# EAGLE design protoboard (EAGLE 9.4.2)

## Sheet 1 of 2
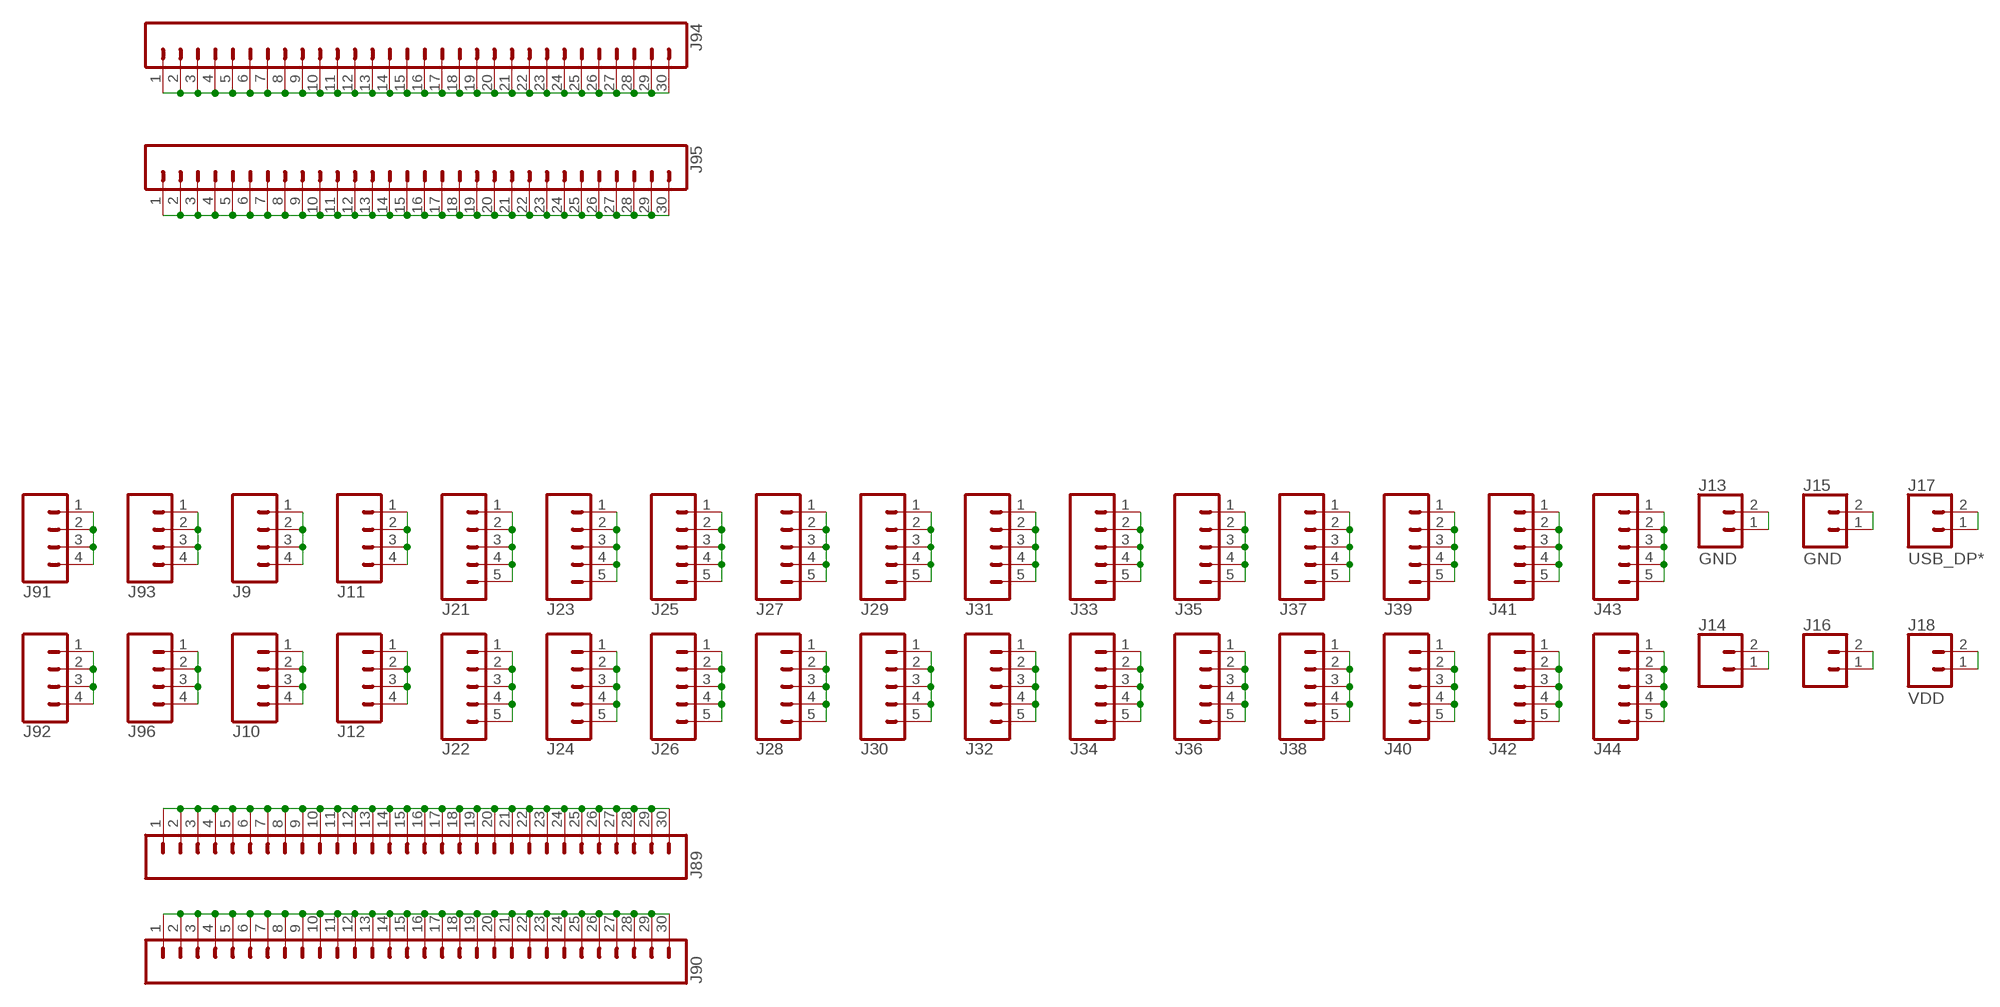
[diagram p0: schematic, sheet 1, part 1 of 2]
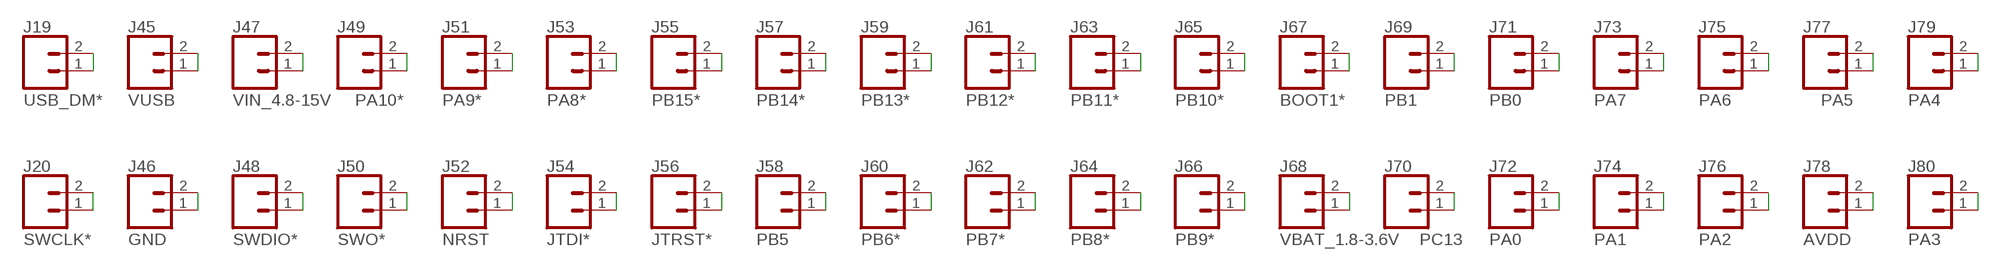
[diagram p1: schematic, sheet 1, part 2 of 2]

### Parts
J9  CONN_041X04_NO_SILK  [1X04_NO_SILK]
J10  CONN_041X04_NO_SILK  [1X04_NO_SILK]
J11  CONN_041X04_NO_SILK  [1X04_NO_SILK]
J12  CONN_041X04_NO_SILK  [1X04_NO_SILK]
J13  CONN_021X02_NO_SILK  [1X02_NO_SILK]
J14  CONN_021X02_NO_SILK  [1X02_NO_SILK]
J15  CONN_021X02_NO_SILK  [1X02_NO_SILK]
J16  CONN_021X02_NO_SILK  [1X02_NO_SILK]
J17  CONN_021X02_NO_SILK  [1X02_NO_SILK]
J18  CONN_021X02_NO_SILK  [1X02_NO_SILK]
J19  CONN_021X02_NO_SILK  [1X02_NO_SILK]
J20  CONN_021X02_NO_SILK  [1X02_NO_SILK]
J21  CONN_05NO_SILK  [1X05_NO_SILK]
J22  CONN_05NO_SILK  [1X05_NO_SILK]
J23  CONN_05NO_SILK  [1X05_NO_SILK]
J24  CONN_05NO_SILK  [1X05_NO_SILK]
J25  CONN_05NO_SILK  [1X05_NO_SILK]
J26  CONN_05NO_SILK  [1X05_NO_SILK]
J27  CONN_05NO_SILK  [1X05_NO_SILK]
J28  CONN_05NO_SILK  [1X05_NO_SILK]
J29  CONN_05NO_SILK  [1X05_NO_SILK]
J30  CONN_05NO_SILK  [1X05_NO_SILK]
J31  CONN_05NO_SILK  [1X05_NO_SILK]
J32  CONN_05NO_SILK  [1X05_NO_SILK]
J33  CONN_05NO_SILK  [1X05_NO_SILK]
J34  CONN_05NO_SILK  [1X05_NO_SILK]
J35  CONN_05NO_SILK  [1X05_NO_SILK]
J36  CONN_05NO_SILK  [1X05_NO_SILK]
J37  CONN_05NO_SILK  [1X05_NO_SILK]
J38  CONN_05NO_SILK  [1X05_NO_SILK]
J39  CONN_05NO_SILK  [1X05_NO_SILK]
J40  CONN_05NO_SILK  [1X05_NO_SILK]
J41  CONN_05NO_SILK  [1X05_NO_SILK]
J42  CONN_05NO_SILK  [1X05_NO_SILK]
J43  CONN_05NO_SILK  [1X05_NO_SILK]
J44  CONN_05NO_SILK  [1X05_NO_SILK]
J45  CONN_021X02_NO_SILK  [1X02_NO_SILK]
J46  CONN_021X02_NO_SILK  [1X02_NO_SILK]
J47  CONN_021X02_NO_SILK  [1X02_NO_SILK]
J48  CONN_021X02_NO_SILK  [1X02_NO_SILK]
J49  CONN_021X02_NO_SILK  [1X02_NO_SILK]
J50  CONN_021X02_NO_SILK  [1X02_NO_SILK]
J51  CONN_021X02_NO_SILK  [1X02_NO_SILK]
J52  CONN_021X02_NO_SILK  [1X02_NO_SILK]
J53  CONN_021X02_NO_SILK  [1X02_NO_SILK]
J54  CONN_021X02_NO_SILK  [1X02_NO_SILK]
J55  CONN_021X02_NO_SILK  [1X02_NO_SILK]
J56  CONN_021X02_NO_SILK  [1X02_NO_SILK]
J57  CONN_021X02_NO_SILK  [1X02_NO_SILK]
J58  CONN_021X02_NO_SILK  [1X02_NO_SILK]
J59  CONN_021X02_NO_SILK  [1X02_NO_SILK]
J60  CONN_021X02_NO_SILK  [1X02_NO_SILK]
J61  CONN_021X02_NO_SILK  [1X02_NO_SILK]
J62  CONN_021X02_NO_SILK  [1X02_NO_SILK]
J63  CONN_021X02_NO_SILK  [1X02_NO_SILK]
J64  CONN_021X02_NO_SILK  [1X02_NO_SILK]
J65  CONN_021X02_NO_SILK  [1X02_NO_SILK]
J66  CONN_021X02_NO_SILK  [1X02_NO_SILK]
J67  CONN_021X02_NO_SILK  [1X02_NO_SILK]
J68  CONN_021X02_NO_SILK  [1X02_NO_SILK]
J69  CONN_021X02_NO_SILK  [1X02_NO_SILK]
J70  CONN_021X02_NO_SILK  [1X02_NO_SILK]
J71  CONN_021X02_NO_SILK  [1X02_NO_SILK]
J72  CONN_021X02_NO_SILK  [1X02_NO_SILK]
J73  CONN_021X02_NO_SILK  [1X02_NO_SILK]
J74  CONN_021X02_NO_SILK  [1X02_NO_SILK]
J75  CONN_021X02_NO_SILK  [1X02_NO_SILK]
J76  CONN_021X02_NO_SILK  [1X02_NO_SILK]
J77  CONN_021X02_NO_SILK  [1X02_NO_SILK]
J78  CONN_021X02_NO_SILK  [1X02_NO_SILK]
J79  CONN_021X02_NO_SILK  [1X02_NO_SILK]
J80  CONN_021X02_NO_SILK  [1X02_NO_SILK]
J89  CONN_30NO_SILK  [1X30_NO_SILK]
J90  CONN_30NO_SILK  [1X30_NO_SILK]
J91  CONN_041X04_NO_SILK  [1X04_NO_SILK]
J92  CONN_041X04_NO_SILK  [1X04_NO_SILK]
J93  CONN_041X04_NO_SILK  [1X04_NO_SILK]
J94  CONN_30NO_SILK  [1X30_NO_SILK]
J95  CONN_30NO_SILK  [1X30_NO_SILK]
J96  CONN_041X04_NO_SILK  [1X04_NO_SILK]

### Nets
AVDD: J78.1 J78.2 ; also sheet 2
BOOT1*: J67.1 J67.2 ; also sheet 2
GND: J13.1 J13.2 J15.1 J15.2 J46.1 J46.2 ; also sheet 2
JTDI*: J54.1 J54.2 ; also sheet 2
JTRST*: J56.1 J56.2 ; also sheet 2
N$1: J90.1 J90.2 J90.3 J90.4 J90.5 J90.6 J90.7 J90.8 J90.9 J90.10 J90.11 J90.12 J90.13 J90.14 J90.15 J90.16 J90.17 J90.18 J90.19 J90.20 J90.21 J90.22 J90.23 J90.24 J90.25 J90.26 J90.27 J90.28 J90.29 J90.30
N$2: J89.1 J89.2 J89.3 J89.4 J89.5 J89.6 J89.7 J89.8 J89.9 J89.10 J89.11 J89.12 J89.13 J89.14 J89.15 J89.16 J89.17 J89.18 J89.19 J89.20 J89.21 J89.22 J89.23 J89.24 J89.25 J89.26 J89.27 J89.28 J89.29 J89.30
N$3: J95.1 J95.2 J95.3 J95.4 J95.5 J95.6 J95.7 J95.8 J95.9 J95.10 J95.11 J95.12 J95.13 J95.14 J95.15 J95.16 J95.17 J95.18 J95.19 J95.20 J95.21 J95.22 J95.23 J95.24 J95.25 J95.26 J95.27 J95.28 J95.29 J95.30
N$4: J94.1 J94.2 J94.3 J94.4 J94.5 J94.6 J94.7 J94.8 J94.9 J94.10 J94.11 J94.12 J94.13 J94.14 J94.15 J94.16 J94.17 J94.18 J94.19 J94.20 J94.21 J94.22 J94.23 J94.24 J94.25 J94.26 J94.27 J94.28 J94.29 J94.30
N$5: J92.1 J92.2 J92.3 J92.4
N$6: J96.1 J96.2 J96.3 J96.4
N$7: J10.1 J10.2 J10.3 J10.4
N$8: J12.1 J12.2 J12.3 J12.4
N$9: J22.1 J22.2 J22.3 J22.4 J22.5
N$10: J24.1 J24.2 J24.3 J24.4 J24.5
N$11: J26.1 J26.2 J26.3 J26.4 J26.5
N$12: J28.1 J28.2 J28.3 J28.4 J28.5
N$13: J30.1 J30.2 J30.3 J30.4 J30.5
N$14: J32.1 J32.2 J32.3 J32.4 J32.5
N$15: J34.1 J34.2 J34.3 J34.4 J34.5
N$16: J36.1 J36.2 J36.3 J36.4 J36.5
N$17: J38.1 J38.2 J38.3 J38.4 J38.5
N$18: J40.1 J40.2 J40.3 J40.4 J40.5
N$19: J42.1 J42.2 J42.3 J42.4 J42.5
N$20: J44.1 J44.2 J44.3 J44.4 J44.5
N$22: J14.1 J14.2
N$23: J16.1 J16.2
N$40: J91.1 J91.2 J91.3 J91.4
N$41: J93.1 J93.2 J93.3 J93.4
N$42: J9.1 J9.2 J9.3 J9.4
N$43: J11.1 J11.2 J11.3 J11.4
N$44: J21.1 J21.2 J21.3 J21.4 J21.5
N$45: J23.1 J23.2 J23.3 J23.4 J23.5
N$46: J25.1 J25.2 J25.3 J25.4 J25.5
N$47: J27.1 J27.2 J27.3 J27.4 J27.5
N$48: J29.1 J29.2 J29.3 J29.4 J29.5
N$49: J31.1 J31.2 J31.3 J31.4 J31.5
N$50: J33.1 J33.2 J33.3 J33.4 J33.5
N$51: J35.1 J35.2 J35.3 J35.4 J35.5
N$52: J37.1 J37.2 J37.3 J37.4 J37.5
N$53: J39.1 J39.2 J39.3 J39.4 J39.5
N$54: J41.1 J41.2 J41.3 J41.4 J41.5
N$55: J43.1 J43.2 J43.3 J43.4 J43.5
NRST: J52.1 J52.2 ; also sheet 2
PA0: J72.1 J72.2 ; also sheet 2
PA1: J74.1 J74.2 ; also sheet 2
PA2: J76.1 J76.2 ; also sheet 2
PA3: J80.1 J80.2 ; also sheet 2
PA4: J79.1 J79.2 ; also sheet 2
PA5: J77.1 J77.2 ; also sheet 2
PA6: J75.1 J75.2 ; also sheet 2
PA7: J73.1 J73.2 ; also sheet 2
PA8*: J53.1 J53.2 ; also sheet 2
PA9*: J51.1 J51.2 ; also sheet 2
PA10*: J49.1 J49.2 ; also sheet 2
PB0: J71.1 J71.2 ; also sheet 2
PB1: J69.1 J69.2 ; also sheet 2
PB5: J58.1 J58.2 ; also sheet 2
PB6*: J60.1 J60.2 ; also sheet 2
PB7*: J62.1 J62.2 ; also sheet 2
PB8*: J64.1 J64.2 ; also sheet 2
PB9*: J66.1 J66.2 ; also sheet 2
PB10*: J65.1 J65.2 ; also sheet 2
PB11*: J63.1 J63.2 ; also sheet 2
PB12*: J61.1 J61.2 ; also sheet 2
PB13*: J59.1 J59.2 ; also sheet 2
PB14*: J57.1 J57.2 ; also sheet 2
PB15*: J55.1 J55.2 ; also sheet 2
PC13: J70.1 J70.2 ; also sheet 2
SWCLK*: J20.1 J20.2 ; also sheet 2
SWDIO*: J48.1 J48.2 ; also sheet 2
SWO*: J50.1 J50.2 ; also sheet 2
USB_DM*: J19.1 J19.2 ; also sheet 2
USB_DP*: J17.1 J17.2 ; also sheet 2
VBAT_1.8-3.6V: J68.1 J68.2 ; also sheet 2
VDD: J18.1 J18.2 ; also sheet 2
VIN_4.8-15V: J47.1 J47.2 ; also sheet 2
VUSB: J45.1 J45.2 ; also sheet 2

## Sheet 2 of 2
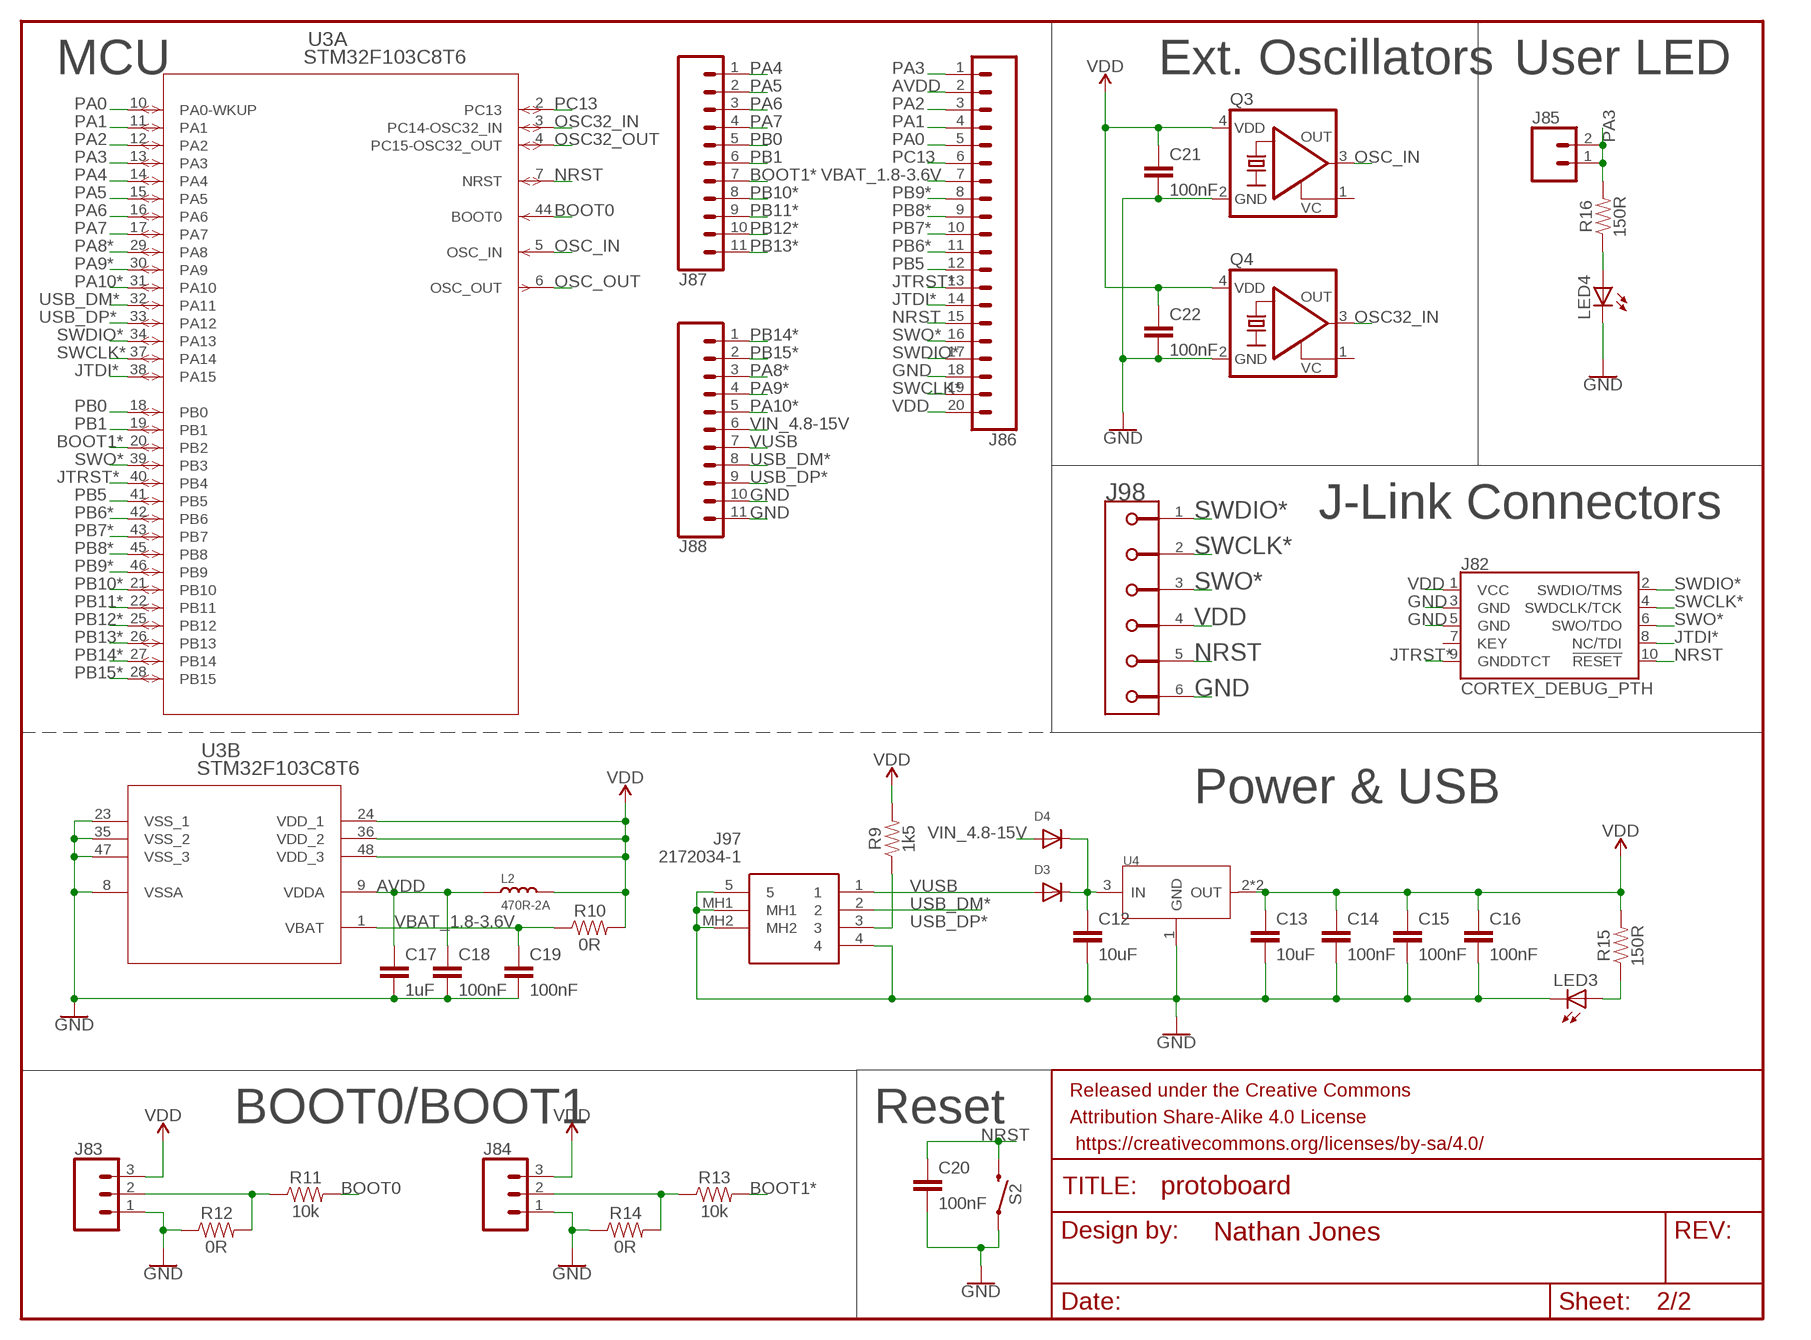
[diagram p2: schematic, sheet 2]

### Parts
C12  10uF  0.1UF-0402T-16V-10%  [0402-TIGHT]
C13  10uF  0.1UF-0402T-16V-10%  [0402-TIGHT]
C14  100nF  0.1UF-0402T-16V-10%  [0402-TIGHT]
C15  100nF  0.1UF-0402T-16V-10%  [0402-TIGHT]
C16  100nF  0.1UF-0402T-16V-10%  [0402-TIGHT]
C17  1uF  0.1UF-0402T-16V-10%  [0402-TIGHT]
C18  100nF  0.1UF-0402T-16V-10%  [0402-TIGHT]
C19  100nF  0.1UF-0402T-16V-10%  [0402-TIGHT]
C20  100nF  0.1UF-0402T-16V-10%  [0402-TIGHT]
C21  100nF  0.1UF-0402T-16V-10%  [0402-TIGHT]
C22  100nF  0.1UF-0402T-16V-10%  [0402-TIGHT]
D3  DIODESOD-123  [SOD-123]
D4  DIODESOD-123  [SOD-123]
FRAME1  FRAME-LETTERNO_PACKAGE  [DUMMY]
J82  CORTEX_DEBUG_PTH  [2X5-PTH-1.27MM]
J83  CONN_031X03_NO_SILK  [1X03_NO_SILK]
J84  CONN_031X03_NO_SILK  [1X03_NO_SILK]
J85  CONN_021X02_NO_SILK  [1X02_NO_SILK]
J86  CONN_20NOSILK  [1X20_NOSILK]
J87  CONN_111X11_NO_SILK  [1X11_NO_SILK]
J88  CONN_111X11_NO_SILK  [1X11_NO_SILK]
J97  2172034-1  [21720341]
J98  AVX_6-PIN_009159006061916_33MIL-GAP  [AVX_6-PIN_009159006061916_33MIL-GAP]
L2  470R-2A  SMD-FERRITE-BEAD-470R-2A(0805)'0805'  [L0805]
LED3  LEDCHIPLED_0603  [CHIPLED_0603]
LED4  LEDCHIPLED_0603  [CHIPLED_0603]
Q3  KXO-VCXO-CMOS_4  [3.2X2.5_KXO-84-TCXO]
Q4  KXO-VCXO-CMOS_4  [3.2X2.5_KXO-84-TCXO]
R9  1k5  RESISTOR0402  [0402]
R10  0R  RESISTOR0402  [0402]
R11  10k  RESISTOR0402  [0402]
R12  0R  RESISTOR0402  [0402]
R13  10k  RESISTOR0402  [0402]
R14  0R  RESISTOR0402  [0402]
R15  150R  RESISTOR0402  [0402]
R16  150R  RESISTOR0402  [0402]
S2  MOMENTARY-SWITCH-SPST-SMD-5.2-REDUNDANT  [TACTILE_SWITCH_SMD_5.2MM]
U3  STM32F103C8T6  [LQFP48-7X7MM]
U4  CJT1117-3.3-SOT223  PMIC-CJT1117-3.3(SOT223)  [SOT-223]

### Nets
AVDD: C17.1 C18.1 J86.2 L2.1 U3.9(B:VDDA) ; also sheet 1
BOOT0: R11.2 U3.44(A:BOOT0)
BOOT1*: J87.7 R13.2 U3.20(A:PB2) ; also sheet 1
GND: C12.2 C13.2 C14.2 C15.2 C16.2 C17.2 C18.2 C19.2 C20.2 C21.2 C22.2 J82.3(GND) J82.5(GND) J83.1 J84.1 J86.18 J88.10 J88.11 J97.4 J97.5 J97.MH1 J97.MH2 J98.6 LED3.C LED4.C Q3.2(GND) Q4.2(GND) R12.1 R14.1 S2.1 S2.2 U3.8(B:VSSA) U3.23(B:VSS_1) U3.35(B:VSS_2) U3.47(B:VSS_3) U4.1(GND) ; also sheet 1
JTDI*: J82.8(NC/TDI) J86.14 U3.38(A:PA15) ; also sheet 1
JTRST*: J82.9(GNDDTCT) J86.13 U3.40(A:PB4) ; also sheet 1
N$58: J83.2 R11.1 R12.2
N$59: J84.2 R13.1 R14.2
N$60: LED4.A R16.1
N$61: LED3.A R15.1
NRST: C20.1 J82.10(!RESET) J86.15 J98.5 S2.3 S2.4 U3.7(A:NRST) ; also sheet 1
OSC32_IN: Q4.3(OUT) U3.3(A:PC14-OSC32_IN)
OSC32_OUT: U3.4(A:PC15-OSC32_OUT)
OSC_IN: Q3.3(OUT) U3.5(A:OSC_IN)
OSC_OUT: U3.6(A:OSC_OUT)
PA0: J86.5 U3.10(A:PA0-WKUP) ; also sheet 1
PA1: J86.4 U3.11(A:PA1) ; also sheet 1
PA2: J86.3 U3.12(A:PA2) ; also sheet 1
PA3: J85.1 J85.2 J86.1 R16.2 U3.13(A:PA3) ; also sheet 1
PA4: J87.1 U3.14(A:PA4) ; also sheet 1
PA5: J87.2 U3.15(A:PA5) ; also sheet 1
PA6: J87.3 U3.16(A:PA6) ; also sheet 1
PA7: J87.4 U3.17(A:PA7) ; also sheet 1
PA8*: J88.3 U3.29(A:PA8) ; also sheet 1
PA9*: J88.4 U3.30(A:PA9) ; also sheet 1
PA10*: J88.5 U3.31(A:PA10) ; also sheet 1
PB0: J87.5 U3.18(A:PB0) ; also sheet 1
PB1: J87.6 U3.19(A:PB1) ; also sheet 1
PB5: J86.12 U3.41(A:PB5) ; also sheet 1
PB6*: J86.11 U3.42(A:PB6) ; also sheet 1
PB7*: J86.10 U3.43(A:PB7) ; also sheet 1
PB8*: J86.9 U3.45(A:PB8) ; also sheet 1
PB9*: J86.8 U3.46(A:PB9) ; also sheet 1
PB10*: J87.8 U3.21(A:PB10) ; also sheet 1
PB11*: J87.9 U3.22(A:PB11) ; also sheet 1
PB12*: J87.10 U3.25(A:PB12) ; also sheet 1
PB13*: J87.11 U3.26(A:PB13) ; also sheet 1
PB14*: J88.1 U3.27(A:PB14) ; also sheet 1
PB15*: J88.2 U3.28(A:PB15) ; also sheet 1
PC13: J86.6 U3.2(A:PC13) ; also sheet 1
SWCLK*: J82.4(SWDCLK/TCK) J86.19 J98.2 U3.37(A:PA14) ; also sheet 1
SWDIO*: J82.2(SWDIO/TMS) J86.17 J98.1 U3.34(A:PA13) ; also sheet 1
SWO*: J82.6(SWO/TDO) J86.16 J98.3 U3.39(A:PB3) ; also sheet 1
USB_DM*: J88.8 J97.2 U3.32(A:PA11) ; also sheet 1
USB_DP*: J88.9 J97.3 R9.1 U3.33(A:PA12) ; also sheet 1
VBAT_1.8-3.6V: C19.1 J86.7 R10.1 U3.1(B:VBAT) ; also sheet 1
VDD: C13.1 C14.1 C15.1 C16.1 C21.1 C22.1 J82.1(VCC) J83.3 J84.3 J86.20 J98.4 L2.2 Q3.4(VDD) Q4.4(VDD) R9.2 R10.2 R15.2 U3.24(B:VDD_1) U3.36(B:VDD_2) U3.48(B:VDD_3) U4.2(OUT) U4.TER(OUT) ; also sheet 1
VIN2: C12.1 D3.C D4.C U4.3(IN)
VIN_4.8-15V: D4.A J88.6 ; also sheet 1
VUSB: D3.A J88.7 J97.1 ; also sheet 1
Unconnected: J82.7(KEY) Q3.1(VC) Q4.1(VC)

### Notes on the sheet
- MCU | Ext. Oscillators | User LED
- J-Link Connectors
- Power & USB
- BOOT0/BOOT1 | Reset

## Library data of the parts
C12 C13 = SparkFun-Capacitors:0.1UF: 0.1µF ceramic capacitors A capacitor is a passive two-terminal electrical component used to store electrical energy temporarily in an electric field.; LCSC_PART: C15525; PROD_ID: CAP-12416; VALUE: 0.1uF
C14-C16 C18-C22 = SparkFun-Capacitors:0.1UF: 0.1µF ceramic capacitors A capacitor is a passive two-terminal electrical component used to store electrical energy temporarily in an electric field.; LCSC_PART: C1525; PROD_ID: CAP-12416; VALUE: 0.1uF
C17 = SparkFun-Capacitors:0.1UF: 0.1µF ceramic capacitors A capacitor is a passive two-terminal electrical component used to store electrical energy temporarily in an electric field.; LCSC_PART: C52923; PROD_ID: CAP-12416; VALUE: 0.1uF
D3 D4 = adafruit:DIODE: Diode SMADIODE - SMA Surface Mount Package 20V 1A Schottky Diode Digikey: 641-1014-6-ND DO-1N4148 - Through Hole Small Current Diode SOD-123 20V 1 A (.5mV Vf) Schottky Diode - Digikey: MBRX120TPMSCT-ND SOD-323 10V 570mA (.38mV Vf, 3ns) Schottky Diode - Digikey: ZLLS410CT-ND SOD-523 30V 30mA Schottky Diode (RB751S-40TE61) - Digikey: RB751S-40TE61CT-ND SOT23-R/W - SOT23 Package (R = Solder Paste/Reflow Ovens, W = Hand-Soldering) BAT54Film 40V 300mA - Digikey: 497-7162-1-ND; LCSC_PART: C8598
FRAME1 = SparkFun-Aesthetics:FRAME-LETTER: Schematic Frame - Letter Standard 8.5x11 US Letter frame; DESIGNER: Nathan Jones; VERSION: v01
J9-J12 J91-J93 J96 = SparkFun-Connectors:CONN_04: Multi connection point. Often used as Generic Header-pin footprint for 0.1 inch spaced/style header connections On any of the 0.1 inch spaced packages, you can populate with these: Break Away Headers - Straight <https://www.sparkfun.com/products/116> (PRT-00116) Break Away Male Headers - Right Angle <https://www.sparkfun.com/products/553> (PRT-00553) Female Headers <https://www.sparkfun.com/products/115> (PRT-00115) Break Away Headers - Machine Pin <https://www.sparkfun.com/products/117> (PRT-00117) Break Away Female Headers - Swiss Machine Pin <https://www.sparkfun.com/products/743> (PRT-00743) For SCREWTERMINALS and SPRING TERMINALS visit here: Screw Terimnals on SparkFun.com <https://www.sparkfun.com/search/results?term=Screw+Terminals> (5mm/3.5mm/2.54mm spacing) This device is also useful as a general connection point to wire up your design to another part of your project. Our various solder wires solder well into these plated through hole pads. Hook-Up Wire - Assortment (Stranded, 22 AWG) <https://www.sparkfun.com/products/11375> (PRT-11375) Hook-Up Wire - Assortment (Solid Core, 22 AWG) <https://www.sparkfun.com/products/11367> (PRT-11367) View the entire wire category on our website here <https://www.sparkfun.com/categories/141> Special notes: Molex polarized connector foot print use with SKU : PRT-08231 with associated crimp pins and housings. 1MM SMD Version SKU: PRT-10208; PROD_ID: CONN-09696
J13-J20 J45-J80 J85 = SparkFun-Connectors:CONN_02: Multi connection point. Often used as Generic Header-pin footprint for 0.1 inch spaced/style header connections On any of the 0.1 inch spaced packages, you can populate with these: Break Away Headers - Straight <https://www.sparkfun.com/products/116> (PRT-00116) Break Away Male Headers - Right Angle <https://www.sparkfun.com/products/553> (PRT-00553) Female Headers <https://www.sparkfun.com/products/115> (PRT-00115) Break Away Headers - Machine Pin <https://www.sparkfun.com/products/117> (PRT-00117) Break Away Female Headers - Swiss Machine Pin <https://www.sparkfun.com/products/743> (PRT-00743) For SCREWTERMINALS and SPRING TERMINALS visit here: Screw Terimnals on SparkFun.com <https://www.sparkfun.com/search/results?term=Screw+Terminals> (5mm/3.5mm/2.54mm spacing) This device is also useful as a general connection point to wire up your design to another part of your project. Our various solder wires solder well into these plated through hole pads. Hook-Up Wire - Assortment (Stranded, 22 AWG) <https://www.sparkfun.com/products/11375> (PRT-11375) Hook-Up Wire - Assortment (Solid Core, 22 AWG) <https://www.sparkfun.com/products/11367> (PRT-11367) View the entire wire category on our website here <https://www.sparkfun.com/categories/141> Special notes: Molex polarized connector foot print use with: PRT-08233 with associated crimp pins and housings. 2.54_SCREWTERM for use with PRT-10571. 3.5mm Screw Terminal footprints for PRT-08084 5mm Screw Terminal footprints for use with PRT-08432
J21-J44 = SparkFun-Connectors:CONN_05: Multi connection point. Often used as Generic Header-pin footprint for 0.1 inch spaced/style header connections On any of the 0.1 inch spaced packages, you can populate with these: Break Away Headers - Straight <https://www.sparkfun.com/products/116> (PRT-00116) Break Away Male Headers - Right Angle <https://www.sparkfun.com/products/553> (PRT-00553) Female Headers <https://www.sparkfun.com/products/115> (PRT-00115) Break Away Headers - Machine Pin <https://www.sparkfun.com/products/117> (PRT-00117) Break Away Female Headers - Swiss Machine Pin <https://www.sparkfun.com/products/743> (PRT-00743) For SCREWTERMINALS and SPRING TERMINALS visit here: Screw Terimnals on SparkFun.com <https://www.sparkfun.com/search/results?term=Screw+Terminals> (5mm/3.5mm/2.54mm spacing) This device is also useful as a general connection point to wire up your design to another part of your project. Our various solder wires solder well into these plated through hole pads. Hook-Up Wire - Assortment (Stranded, 22 AWG) <https://www.sparkfun.com/products/11375> (PRT-11375) Hook-Up Wire - Assortment (Solid Core, 22 AWG) <https://www.sparkfun.com/products/11367> (PRT-11367) View the entire wire category on our website here <https://www.sparkfun.com/categories/141> Special notes: Molex polarized connector foot print use with SKU : PRT-08231 with associated crimp pins and housings. 1MM SMD Version SKU: PRT-10208
J82 = SparkFun-Connectors:CORTEX_DEBUG: Cortex Debug Connector - 10 pin Supports JTAG debug, Serial Wire debug, and Serial Wire Viewer. PTH and SMD connector options available. General Connector Information <http://infocenter.arm.com/help/topic/com.arm.doc.faqs/attached/13634/cortex_debug_connectors.pdf> Products: PTH Connector <http://www.digikey.com/product-detail/en/cnc-tech/3220-10-0100-00/1175-1627-ND/3883661> -via Digi-Key SparkFun PSoc <https://www.sparkfun.com/products/13229> SparkFun T <https://www.sparkfun.com/products/13810>
J83 J84 = SparkFun-Connectors:CONN_03: Multi connection point. Often used as Generic Header-pin footprint for 0.1 inch spaced/style header connections On any of the 0.1 inch spaced packages, you can populate with these: Break Away Headers - Straight <https://www.sparkfun.com/products/116> (PRT-00116) Break Away Male Headers - Right Angle <https://www.sparkfun.com/products/553> (PRT-00553) Female Headers <https://www.sparkfun.com/products/115> (PRT-00115) Break Away Headers - Machine Pin <https://www.sparkfun.com/products/117> (PRT-00117) Break Away Female Headers - Swiss Machine Pin <https://www.sparkfun.com/products/743> (PRT-00743) Stackable Header - 3 Pin (Female, 0.1") <https://www.sparkfun.com/products/13875> (PRT-13875) For SCREWTERMINALS and SPRING TERMINALS visit here: Screw Terimnals on SparkFun.com <https://www.sparkfun.com/search/results?term=Screw+Terminals> (5mm/3.5mm/2.54mm spacing) This device is also useful as a general connection point to wire up your design to another part of your project. Our various solder wires solder well into these plated through hole pads. Hook-Up Wire - Assortment (Stranded, 22 AWG) <https://www.sparkfun.com/products/11375> (PRT-11375) Hook-Up Wire - Assortment (Solid Core, 22 AWG) <https://www.sparkfun.com/products/11367> (PRT-11367) View the entire wire category on our website here <https://www.sparkfun.com/categories/141> Special notes: Molex polarized connector foot print use with SKU : PRT-08232 with associated crimp pins and housings.
J86 = SparkFun-Connectors:CONN_20: Multi connection point. Often used as Generic Header-pin footprint for 0.1 inch spaced/style header connections On any of the 0.1 inch spaced packages, you can populate with these: Break Away Headers - Straight <https://www.sparkfun.com/products/116> (PRT-00116) Break Away Male Headers - Right Angle <https://www.sparkfun.com/products/553> (PRT-00553) Female Headers <https://www.sparkfun.com/products/115> (PRT-00115) Break Away Headers - Machine Pin <https://www.sparkfun.com/products/117> (PRT-00117) Break Away Female Headers - Swiss Machine Pin <https://www.sparkfun.com/products/743> (PRT-00743) For SCREWTERMINALS and SPRING TERMINALS visit here: Screw Terimnals on SparkFun.com <https://www.sparkfun.com/search/results?term=Screw+Terminals> (5mm/3.5mm/2.54mm spacing) This device is also useful as a general connection point to wire up your design to another part of your project. Our various solder wires solder well into these plated through hole pads. Hook-Up Wire - Assortment (Stranded, 22 AWG) <https://www.sparkfun.com/products/11375> (PRT-11375) Hook-Up Wire - Assortment (Solid Core, 22 AWG) <https://www.sparkfun.com/products/11367> (PRT-11367) View the entire wire category on our website here <https://www.sparkfun.com/categories/141> Special notes: Molex polarized connector foot print use with SKU : PRT-08231 with associated crimp pins and housings. 1MM SMD Version SKU: PRT-10208 NOTES ON THE VARIANTS LOCK and LOCK_LONGPADS... This footprint was designed to help hold the alignment of a through-hole component (i.e. 6-pin header) while soldering it into place. You may notice that each hole has been shifted either up or down by 0.005 of an inch from it's more standard position (which is a perfectly straight line). This slight alteration caused the pins (the squares in the middle) to touch the edges of the holes. Because they are alternating, it causes a "brace" to hold the component in place. 0.005 has proven to be the perfect amount of "off-center" position when using our standard breakaway headers. Although looks a little odd when you look at the bare footprint, once you have a header in there, the alteration is very hard to notice. Also,if you push a header all the way into place, it is covered up entirely on the bottom side. Note about LOCK SPECIAL package: This is just like the LOCK variant in that the holes are staggared by 5 mil, but except for the last two holes. They are not altered from the "standard" footprint layout. This is used for a special purpose on the layout of our Graphic LCD Backpack. Make sure you want to use this device before selecting it for you project!
J87 J88 = SparkFun-Connectors:CONN_11: Multi connection point. Often used as Generic Header-pin footprint for 0.1 inch spaced/style header connections On any of the 0.1 inch spaced packages, you can populate with these: Break Away Headers - Straight <https://www.sparkfun.com/products/116> (PRT-00116) Break Away Male Headers - Right Angle <https://www.sparkfun.com/products/553> (PRT-00553) Female Headers <https://www.sparkfun.com/products/115> (PRT-00115) Break Away Headers - Machine Pin <https://www.sparkfun.com/products/117> (PRT-00117) Break Away Female Headers - Swiss Machine Pin <https://www.sparkfun.com/products/743> (PRT-00743) For SCREWTERMINALS and SPRING TERMINALS visit here: Screw Terimnals on SparkFun.com <https://www.sparkfun.com/search/results?term=Screw+Terminals> (5mm/3.5mm/2.54mm spacing) This device is also useful as a general connection point to wire up your design to another part of your project. Our various solder wires solder well into these plated through hole pads. Hook-Up Wire - Assortment (Stranded, 22 AWG) <https://www.sparkfun.com/products/11375> (PRT-11375) Hook-Up Wire - Assortment (Solid Core, 22 AWG) <https://www.sparkfun.com/products/11367> (PRT-11367) View the entire wire category on our website here <https://www.sparkfun.com/categories/141>
J89 J90 J94 J95 = SparkFun-Connectors:CONN_30: Multi connection point. Often used as Generic Header-pin footprint for 0.1 inch spaced/style header connections On any of the 0.1 inch spaced packages, you can populate with these: Break Away Headers - Straight <https://www.sparkfun.com/products/116> (PRT-00116) Break Away Male Headers - Right Angle <https://www.sparkfun.com/products/553> (PRT-00553) Female Headers <https://www.sparkfun.com/products/115> (PRT-00115) Break Away Headers - Machine Pin <https://www.sparkfun.com/products/117> (PRT-00117) Break Away Female Headers - Swiss Machine Pin <https://www.sparkfun.com/products/743> (PRT-00743) For SCREWTERMINALS and SPRING TERMINALS visit here: Screw Terimnals on SparkFun.com <https://www.sparkfun.com/search/results?term=Screw+Terminals> (5mm/3.5mm/2.54mm spacing) This device is also useful as a general connection point to wire up your design to another part of your project. Our various solder wires solder well into these plated through hole pads. Hook-Up Wire - Assortment (Stranded, 22 AWG) <https://www.sparkfun.com/products/11375> (PRT-11375) Hook-Up Wire - Assortment (Solid Core, 22 AWG) <https://www.sparkfun.com/products/11367> (PRT-11367) View the entire wire category on our website here <https://www.sparkfun.com/categories/141> Special notes: Molex polarized connector foot print use with SKU : PRT-08231 with associated crimp pins and housings. 1MM SMD Version SKU: PRT-10208 NOTES ON THE VARIANTS LOCK and LOCK_LONGPADS... This footprint was designed to help hold the alignment of a through-hole component (i.e. 6-pin header) while soldering it into place. You may notice that each hole has been shifted either up or down by 0.005 of an inch from it's more standard position (which is a perfectly straight line). This slight alteration caused the pins (the squares in the middle) to touch the edges of the holes. Because they are alternating, it causes a "brace" to hold the component in place. 0.005 has proven to be the perfect amount of "off-center" position when using our standard breakaway headers. Although looks a little odd when you look at the bare footprint, once you have a header in there, the alteration is very hard to notice. Also,if you push a header all the way into place, it is covered up entirely on the bottom side.
J97 = 2172034-1:2172034-1: CONN RCPT USB MINI B 2.0 PCB R/A Source: Datasheet <https://www.te.com/commerce/DocumentDelivery/DDEController?Action=srchrtrv&DocNm=2172034&DocType=Customer Drawing&DocLang=English>; ARROW_PART_NUMBER: 2172034-1; ARROW_PRICE-STOCK: https://www.arrow.com/en/products/2172034-1/te-connectivity; DESCRIPTION: CONN RCPT USB MINI B 2.0 PCB R/A; HEIGHT: 3.9mm; MANUFACTURER_NAME: TE Connectivity; MANUFACTURER_PART_NUMBER: 2172034-1; MOUSER_PART_NUMBER: 571-2172034-1; MOUSER_PRICE-STOCK: https://www.mouser.co.uk/ProductDetail/TE-Connectivity/2172034-1/?qs=Ev%252BS503VEAHBC%252BPBdsvCGg%3D%3D
J98 = Debug-Edge_AVX-connectors:AVX_6-PIN_009159006061916_33MIL-GAP
L2 = OPL_Ferrite_and_Magnetic_Bead:SMD-FERRITE-BEAD-470R-2A(0805): 303030008; LCSC_PART: C1015; MPN: WLB2012-471T20
LED3 = adafruit:LED: LED OSRAM: - CHIPLED LG R971, LG N971, LY N971, LG Q971, LY Q971, LO R971, LY R971 LH N974, LH R974 LS Q976, LO Q976, LY Q976 LO Q996 - Hyper CHIPLED LW Q18S LB Q993, LB Q99A, LB R99A - SideLED LS A670, LO A670, LY A670, LG A670, LP A670 LB A673, LV A673, LT A673, LW A673 LH A674 LY A675 LS A676, LA A676, LO A676, LY A676, LW A676 LS A679, LY A679, LG A679 - Hyper Micro SIDELED® LS Y876, LA Y876, LO Y876, LY Y876 LT Y87S - SmartLED LW L88C, LW L88S LB L89C, LB L89S, LG L890 LS L89K, LO L89K, LY L89K LS L896, LA L896, LO L896, LY L896 - TOPLED LS T670, LO T670, LY T670, LG T670, LP T670 LSG T670, LSP T670, LSY T670, LOP T670, LYG T670 LG T671, LOG T671, LSG T671 LB T673, LV T673, LT T673, LW T673 LH T674 LS T676, LA T676, LO T676, LY T676, LB T676, LH T676, LSB T676, LW T676 LB T67C, LV T67C, LT T67C, LS T67K, LO T67K, LY T67K, LW E67C LS E67B, LA E67B, LO E67B, LY E67B, LB E67C, LV E67C, LT E67C LW T67C LS T679, LY T679, LG T679 LS T770, LO T770, LY T770, LG T770, LP T770 LB T773, LV T773, LT T773, LW T773 LH T774 LS E675, LA E675, LY E675, LS T675 LS T776, LA T776, LO T776, LY T776, LB T776 LHGB T686 LT T68C, LB T68C - Hyper Mini TOPLED® LB M676 - Mini TOPLED Santana® LG M470 LS M47K, LO M47K, LY M47K Source: http://www.osram.convergy.de/; LCSC_PART: C72041
LED4 = adafruit:LED: LED OSRAM: - CHIPLED LG R971, LG N971, LY N971, LG Q971, LY Q971, LO R971, LY R971 LH N974, LH R974 LS Q976, LO Q976, LY Q976 LO Q996 - Hyper CHIPLED LW Q18S LB Q993, LB Q99A, LB R99A - SideLED LS A670, LO A670, LY A670, LG A670, LP A670 LB A673, LV A673, LT A673, LW A673 LH A674 LY A675 LS A676, LA A676, LO A676, LY A676, LW A676 LS A679, LY A679, LG A679 - Hyper Micro SIDELED® LS Y876, LA Y876, LO Y876, LY Y876 LT Y87S - SmartLED LW L88C, LW L88S LB L89C, LB L89S, LG L890 LS L89K, LO L89K, LY L89K LS L896, LA L896, LO L896, LY L896 - TOPLED LS T670, LO T670, LY T670, LG T670, LP T670 LSG T670, LSP T670, LSY T670, LOP T670, LYG T670 LG T671, LOG T671, LSG T671 LB T673, LV T673, LT T673, LW T673 LH T674 LS T676, LA T676, LO T676, LY T676, LB T676, LH T676, LSB T676, LW T676 LB T67C, LV T67C, LT T67C, LS T67K, LO T67K, LY T67K, LW E67C LS E67B, LA E67B, LO E67B, LY E67B, LB E67C, LV E67C, LT E67C LW T67C LS T679, LY T679, LG T679 LS T770, LO T770, LY T770, LG T770, LP T770 LB T773, LV T773, LT T773, LW T773 LH T774 LS E675, LA E675, LY E675, LS T675 LS T776, LA T776, LO T776, LY T776, LB T776 LHGB T686 LT T68C, LB T68C - Hyper Mini TOPLED® LB M676 - Mini TOPLED Santana® LG M470 LS M47K, LO M47K, LY M47K Source: http://www.osram.convergy.de/; LCSC_PART: C72038
Q3 = crystal-geyer_V1_0:KXO-VCXO-CMOS_4: VCXO : CMOS - Serie Model Size l/w/h [mm] Frequency Range Frequency Stability Temp. Range [°C] Output AECQ 200 availabel Datasheet KXO-84 3.2/2.5/1.0 1.25 ~ 54.0 MHz ±10 … ±50ppm (*) -40°C …+85°C CMOS - KXO-84.pdf <http://www.geyer-electronic.de/uploads/tx_userartikelfrequenz/GEYER-KXO-84-VCXO-CMOS.pdf> <http://www.geyer-electronic.de/fileadmin/template/img/logo-geyer-electronic.png> Details see: http://www.geyer-electronic.de/Frequenz-Produkte.9.0.html Created 2016-06-07, Hans Locher 2016 (C) Geyer Quartz Technology KX84;3,2x2,5;3.2x2.5;3225; LCSC_PART: C39097
Q4 = crystal-geyer_V1_0:KXO-VCXO-CMOS_4: VCXO : CMOS - Serie Model Size l/w/h [mm] Frequency Range Frequency Stability Temp. Range [°C] Output AECQ 200 availabel Datasheet KXO-84 3.2/2.5/1.0 1.25 ~ 54.0 MHz ±10 … ±50ppm (*) -40°C …+85°C CMOS - KXO-84.pdf <http://www.geyer-electronic.de/uploads/tx_userartikelfrequenz/GEYER-KXO-84-VCXO-CMOS.pdf> <http://www.geyer-electronic.de/fileadmin/template/img/logo-geyer-electronic.png> Details see: http://www.geyer-electronic.de/Frequenz-Produkte.9.0.html Created 2016-06-07, Hans Locher 2016 (C) Geyer Quartz Technology KX84;3,2x2,5;3.2x2.5;3225; LCSC_PART: C387415
R9 = SparkFun-Resistors:RESISTOR: Generic Resistor Package; LCSC_PART: C25867
R10 R12 R14 = SparkFun-Resistors:RESISTOR: Generic Resistor Package; LCSC_PART: C17168
R11 R13 = SparkFun-Resistors:RESISTOR: Generic Resistor Package; LCSC_PART: C25744
R15 R16 = SparkFun-Resistors:RESISTOR: Generic Resistor Package; LCSC_PART: C25082
S2 = SparkFun-Switches:MOMENTARY-SWITCH-SPST: Momentary Switch (Pushbutton) - SPST Normally-open (NO) SPST momentary switches (buttons, pushbuttons). Variants PTH-12MM - 12mm square, through-hole Momentary Pushbutton Switch - 12mm Square <https://www.sparkfun.com/products/9190> (COM-09190) PTH-6.0MM, PTH-6.0MM-KIT - 6.0mm square, through-hole Mini Pushbutton Switch <https://www.sparkfun.com/products/97> (COM-00097) KIT package intended for soldering kit's - only one side of pads' copper is exposed. PTH-RIGHT-ANGLE-KIT - Right-angle, through-hole Right Angle Tactile Button <https://www.sparkfun.com/products/10791> - Used on SparkFun BigTime Watch Kit <https://www.sparkfun.com/products/11734> SMD-12MM - 12mm square, surface-mount Tactile Button - SMD (12mm) <https://www.sparkfun.com/products/12993> (COM-12993) Used on SparkFun PicoBoard <https://www.sparkfun.com/products/11888> SMD-4.5MM - 4.5mm Square Trackball Switch Used on SparkFun Blackberry Trackballer Breakout <https://www.sparkfun.com/products/13169> SMD-4.6MMX2.8MM - 4.60mm x 2.80mm, surface mount Used on SparkFun SAMD21 Mini Breakout <https://www.sparkfun.com/products/13664> SMD-5.2MM, SMD-5.2-REDUNDANT - 5.2mm square, surface-mount Mini Pushbutton Switch - SMD <https://www.sparkfun.com/products/8720> (COM-08720) Used on Arduino Pro Mini <https://www.sparkfun.com/products/11114> REDUNDANT package connects both switch circuits together SMD-6.0X3.5MM - 6.0 x 3.5mm, surface mount Momentary Reset Switch SMD <https://www.sparkfun.com/products/8229> (COM-08229) SMD-6.2MM-TALL - 6.2mm square, surface mount Tactile Button - SMD (6mm) <https://www.sparkfun.com/products/12992> Used on SparkFun Digital Sandbox <https://www.sparkfun.com/products/12651> SMD-RIGHT-ANGLE - Right-angle, surface mount Used on SparkFun Block for Intel® Edison - Arduino <https://www.sparkfun.com/products/13036>; LCSC_PART: C318884; PROD_ID: SWCH-08247; SF_SKU: COM-08720
U3 = STM32F103C8T6:STM32F103C8T6; BUILT_BY: EMA_UL_Team; COPYRIGHT: Copyright (C) 2018 Accelerated Designs. All rights reserved; LCSC_PART: C94046; MANUFACTURER_PART_NUMBER: STM32F103C8T6; SOURCELIBRARY: Updates_to_database_2020-10-19; VENDOR: STMicroelectronics
U4 = OPL_IC:PMIC-CJT1117-3.3(SOT223): 310030097; LCSC_PART: C6186; MPN: CJT1117-3.3

## Board
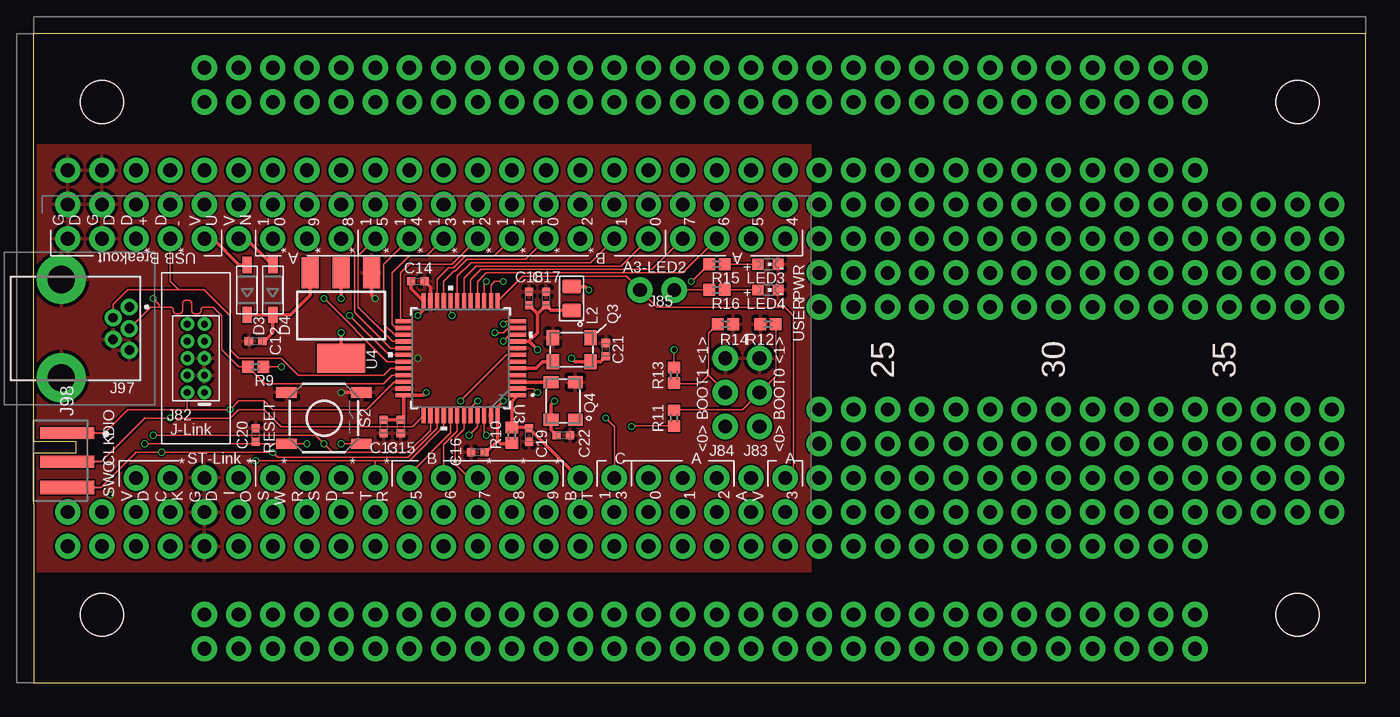
[diagram p3: board, top side]
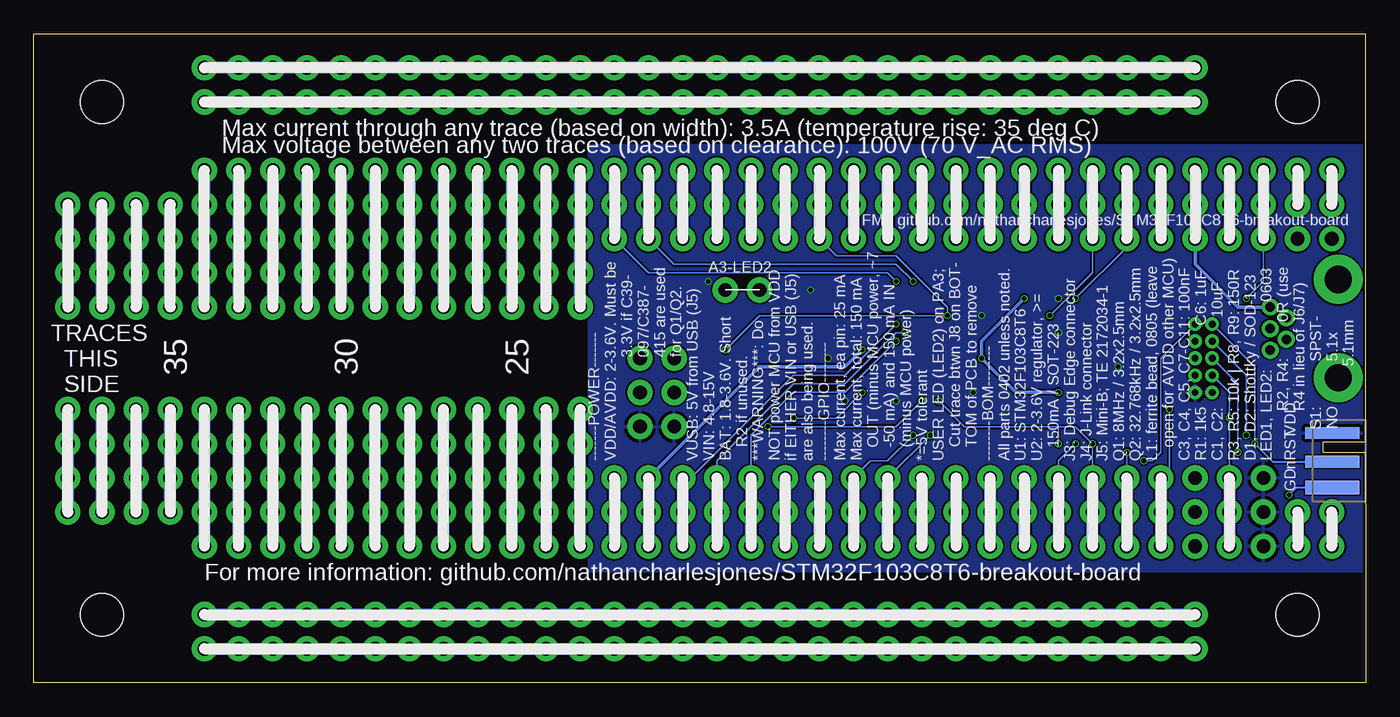
[diagram p4: board, bottom side, seen from below]

Size 99.06 x 48.26 mm. Coordinates in mm from the lower left corner, seen from the top.
Outline: 99.06,0 99.06,48.26 0,48.26 0,34.92 0,17.93 3.17,17.93 3.17,17.09 0,17.09 0,13.34 0,0 99.06,0
Copper layers (1*16): Top 0.035mm / dielectric 1.6mm / Bottom 0.035mm
Design rules "jlcpcb-2layers": minimum track width 5mil, minimum drill 0.3mm, track to track 5mil, track to pad 5mil, pad to pad 5mil, via to via 5mil, smd to smd 5mil, copper to edge 0.2mm, drill to drill 6mil, minimum pad ring 10mil, minimum via ring 3mil, stop-mask expansion 4mil, vias tented up to drill 0mil, thermal gap 10mil
Holes 3.17 mm at 93.98,43.18 93.98,5.08 5.08,43.18 5.08,5.08

### Footprints (pad centres in the part's own frame; a part is rotated, then mirrored left to right if it is on the bottom)
0402-TIGHT = smd 0.6 x 0.6: 1 -0.5,0; 2 0.5,0
SOD-123 = smd 1.2 x 0.7: A 1.85,0; C -1.85,0
1X04_NO_SILK = drill 1.016 pad 1.88: 1 0,0; 2 2.54,0; 3 5.08,0; 4 7.62,0
1X02_NO_SILK = drill 1.016 pad 1.88: 1 0,0; 2 2.54,0
1X05_NO_SILK = drill 1.016 pad 1.88: 1 0,0; 2 2.54,0; 3 5.08,0; 4 7.62,0; 5 10.16,0
2X5-PTH-1.27MM = drill 0.508 pad 1: 1 -2.54,-0.635; 2 -2.54,0.635; 3 -1.27,-0.635; 4 -1.27,0.635; 5 0,-0.635; 6 0,0.635; 7 1.27,-0.635; 8 1.27,0.635; 9 2.54,-0.635; 10 2.54,0.635
1X03_NO_SILK = drill 1.016 pad 1.88: 1 0,0; 2 2.54,0; 3 5.08,0
1X20_NOSILK = drill 1.016 pad 1.88: 1 0,0; 2 2.54,0; 3 5.08,0; 4 7.62,0; 5 10.16,0; 6 12.7,0; 7 15.24,0; 8 17.78,0; 9 20.32,0; 10 22.86,0; 11 25.4,0; 12 27.94,0; 13 30.48,0; 14 33.02,0; 15 35.56,0; 16 38.1,0; 17 40.64,0; 18 43.18,0; 19 45.72,0; 20 48.26,0
1X11_NO_SILK = drill 1.016 pad 1.88: 1 0,0; 2 2.54,0; 3 5.08,0; 4 7.62,0; 5 10.16,0; 6 12.7,0; 7 15.24,0; 8 17.78,0; 9 20.32,0; 10 22.86,0; 11 25.4,0
1X30_NO_SILK = drill 1.016 pad 1.88: 1 0,0; 2 2.54,0; 3 5.08,0; 4 7.62,0; 5 10.16,0; 6 12.7,0; 7 15.24,0; 8 17.78,0; 9 20.32,0; 10 22.86,0; 11 25.4,0; 12 27.94,0; 13 30.48,0; 14 33.02,0; 15 35.56,0; 16 38.1,0; 17 40.64,0; 18 43.18,0; 19 45.72,0; 20 48.26,0; 21 50.8,0; 22 53.34,0; 23 55.88,0; 24 58.42,0; 25 60.96,0; 26 63.5,0; 27 66.04,0; 28 68.58,0; 29 71.12,0; 30 73.66,0
21720341 = drill 0.7 pad 1.2: 1 0,0; 2 1.2,0.8; 3 0,1.6; 4 1.2,2.4; 5 0,3.2 | drill 2.025 pad 3.037: MH1 5.05,5.25; MH2 5.05,-2.05
AVX_6-PIN_009159006061916_33MIL-GAP = smd 0.873 x 4: 1 -2.063,2.5; 2 0.064,2.5 | smd 1 x 4: 3 2,2.5 | smd 0.873 x 4 bottom: 4 -2.063,2.5; 5 0.064,2.5 | smd 1 x 4 bottom: 6 2,2.5
L0805 = smd 1.016 x 1.397: 1 -0.889,0; 2 0.889,0
CHIPLED_0603 = smd 0.8 x 0.8: A 0,-0.75; C 0,0.75
3.2X2.5_KXO-84-TCXO = smd 0.9 x 1.1: 1 -1.4,-0.9; 2 1.4,-0.9; 3 1.4,0.9; 4 -1.4,0.9
0402 = smd 0.85 x 0.9: 1 -0.58,0; 2 0.58,0
TACTILE_SWITCH_SMD_5.2MM = smd 1.524 x 0.762: 1 -2.794,1.905; 2 2.794,1.905; 3 -2.794,-1.905; 4 2.794,-1.905
LQFP48-7X7MM = smd 1.194 x 0.305: 1 -4.25,2.75; 2 -4.25,2.25; 3 -4.25,1.75; 4 -4.25,1.25; 5 -4.25,0.75; 6 -4.25,0.25; 7 -4.25,-0.25; 8 -4.25,-0.75; 9 -4.25,-1.25; 10 -4.25,-1.75; 11 -4.25,-2.25; 12 -4.25,-2.75; 25 4.25,-2.75; 26 4.25,-2.25; 27 4.25,-1.75; 28 4.25,-1.25; 29 4.25,-0.75; 30 4.25,-0.25; 31 4.25,0.25; 32 4.25,0.75; 33 4.25,1.25; 34 4.25,1.75; 35 4.25,2.25; 36 4.25,2.75 | smd 0.305 x 1.194: 13 -2.75,-4.25; 14 -2.25,-4.25; 15 -1.75,-4.25; 16 -1.25,-4.25; 17 -0.75,-4.25; 18 -0.25,-4.25; 19 0.25,-4.25; 20 0.75,-4.25; 21 1.25,-4.25; 22 1.75,-4.25; 23 2.25,-4.25; 24 2.75,-4.25; 37 2.75,4.25; 38 2.25,4.25; 39 1.75,4.25; 40 1.25,4.25; 41 0.75,4.25; 42 0.25,4.25; 43 -0.25,4.25; 44 -0.75,4.25; 45 -1.25,4.25; 46 -1.75,4.25; 47 -2.25,4.25; 48 -2.75,4.25
SOT-223 = smd 1.27 x 2.286: 1 -2.286,-3.175; 2 0,-3.175; 3 2.286,-3.175 | smd 3.556 x 2.159: TER 0,3.175

### Placement (x,y rotation side)
C12  16.51,25.4 180 top
C13  26.04,19.05 270 top
C14  28.57,29.84 0 top
C15  27.3,19.05 270 top
C16  33.02,17.14 180 top
C17  38.1,28.57 90 top
C18  36.83,28.57 90 top
C19  36.83,18.41 270 top
C20  16.51,18.41 90 top
C21  42.55,24.77 90 top
C22  39.37,18.41 0 top
D3  15.88,29.21 90 top
D4  17.78,29.21 90 top
FRAME1  0.64,34.92 270 top
J9  91.44,27.94 90 top
J10  91.44,12.7 90 top
J11  88.9,27.94 90 top
J12  88.9,12.7 90 top
J13  2.54,35.56 90 top
J14  2.54,10.16 90 top
J15  5.08,35.56 90 top
J16  5.08,10.16 90 top
J17  7.62,35.56 90 top
J18  7.62,10.16 90 top
J19  10.16,35.56 90 top
J20  10.16,10.16 90 top
J21  86.36,27.94 90 top
J22  86.36,10.16 90 top
J23  83.82,27.94 90 top
J24  83.82,10.16 90 top
J25  81.28,27.94 90 top
J26  81.28,10.16 90 top
J27  78.74,27.94 90 top
J28  78.74,10.16 90 top
J29  76.2,27.94 90 top
J30  76.2,10.16 90 top
J31  73.66,27.94 90 top
J32  73.66,10.16 90 top
J33  71.12,27.94 90 top
J34  71.12,10.16 90 top
J35  68.58,27.94 90 top
J36  68.58,10.16 90 top
J37  66.04,27.94 90 top
J38  66.04,10.16 90 top
J39  63.5,27.94 90 top
J40  63.5,10.16 90 top
J41  60.96,27.94 90 top
J42  60.96,10.16 90 top
J43  58.42,27.94 90 top
J44  58.42,10.16 90 top
J45  12.7,35.56 90 top
J46  12.7,10.16 90 top
J47  15.24,35.56 90 top
J48  15.24,10.16 90 top
J49  17.78,35.56 90 top
J50  17.78,10.16 90 top
J51  20.32,35.56 90 top
J52  20.32,10.16 90 top
J53  22.86,35.56 90 top
J54  22.86,10.16 90 top
J55  25.4,35.56 90 top
J56  25.4,10.16 90 top
J57  27.94,35.56 90 top
J58  27.94,10.16 90 top
J59  30.48,35.56 90 top
J60  30.48,10.16 90 top
J61  33.02,35.56 90 top
J62  33.02,10.16 90 top
J63  35.56,35.56 90 top
J64  35.56,10.16 90 top
J65  38.1,35.56 90 top
J66  38.1,10.16 90 top
J67  40.64,35.56 90 top
J68  40.64,10.16 90 top
J69  43.18,35.56 90 top
J70  43.18,10.16 90 top
J71  45.72,35.56 90 top
J72  45.72,10.16 90 top
J73  48.26,35.56 90 top
J74  48.26,10.16 90 top
J75  50.8,35.56 90 top
J76  50.8,10.16 90 top
J77  53.34,35.56 90 top
J78  53.34,10.16 90 top
J79  55.88,35.56 90 top
J80  55.88,10.16 90 top
J82  12.06,24.13 90 top
J83  53.98,24.13 270 top
J84  51.44,24.13 270 top
J85  45.09,29.21 0 top
J86  55.88,15.24 180 top
J87  55.88,33.02 180 top
J88  27.94,33.02 180 top
J89  12.7,5.08 0 top
J90  12.7,2.54 0 top
J91  96.52,27.94 90 top
J92  96.52,12.7 90 top
J93  93.98,27.94 90 top
J94  12.7,45.72 0 top
J95  12.7,43.18 0 top
J96  93.98,12.7 90 top
J97  7.11,27.94 180 top
J98  0,16.51 270 top
L2  40.01,28.57 90 top
LED3  54.61,31.11 270 top
LED4  54.61,29.21 270 top
Q3  40.01,24.77 180 top
Q4  39.37,20.95 90 top
R9  16.51,23.5 0 top
R10  35.56,18.41 270 top
R11  47.62,19.68 270 top
R12  54.61,26.67 0 top
R13  47.62,22.86 90 top
R14  51.44,26.67 180 top
R15  50.8,31.11 180 top
R16  50.8,29.21 180 top
S2  21.59,19.68 0 top
U3  31.75,24.13 180 top
U4  22.86,27.3 180 top

### Tracks (layer width: path | path; a pad name or v marks a point on that pad's centre or on a via)
AVDD  (via drill 0.35)
  Top 0.254: 36.81,25.38 37.47,26.04 37.47,27.44 | 36.81,25.38 36.85,25.38 v37.47,24.77 | 36.81,25.38 U3.9 | L2.1 38.49,27.69 C17.1 37.47,27.44 | C18.1 37.47,27.44
  Bottom 0.254: v37.47,24.77 38.73,23.5 45.09,23.5 J86.2
  Bottom 0.889: J78.1 J78.2 J86.2
BOOT0  (via drill 0.35)
  Top 0.127: U3.44 32.5,20.43 v33.02,20.95 | v44.45,19.05 44.51,19.11 R11.2
  Bottom 0.127: v33.02,20.95 34.92,19.05 v44.45,19.05
BOOT1*  (via drill 0.35)
  Top 0.127: U3.20 31,27.42 v31.11,27.3 | v47.62,24.77 R13.2
  Bottom 0.127: v47.62,24.77 45.09,27.3 v31.11,27.3 31.11,27.94 34.92,31.75 39.37,31.75 J87.7
  Bottom 0.889: J67.2 J67.1 J87.7
GND  (via drill 0.35)
  Top 0.254: U4.1 25.15,28.83 v25.4,28.57 | S2.2 v22.86,21.59 | C14.2 29.5,29.42 U3.23
  Bottom 0.152: J98.6 5.17,14.51 v5.71,13.97
  Bottom 0.254: v25.4,28.57 28.57,25.4 v28.57,24.13 26.04,21.59 v22.86,21.59
  Bottom 0.889: J13.2 J13.1 | J15.1 J15.2
  pour Top: 57.78,40.01 57.78,8.26 0,8.26 0,40.01
JTDI*  (via drill 0.35)
  Top 0.127: U3.38 29.5,18.79 27.86,17.14 22.23,17.14 v21.59,17.78 20.95,18.41 v8.89,18.41
  Bottom 0.127: v8.89,18.41 8.89,22.86 J82.8 | v21.59,17.78 22.86,16.51 J86.14
  Bottom 0.889: J54.1 J54.2 J86.14
JTRST*  (via drill 0.35)
  Top 0.127: U3.40 30.5,19.07 27.94,16.51 25.4,16.51 | J86.13 25.4,16.51 | 25.4,16.51 v16.51,16.51
  Bottom 0.127: v16.51,16.51 15.88,16.51 15.24,17.14 15.24,24.13 J82.9
  Bottom 0.889: J56.1 J56.2 J86.13
N$1
  Bottom 0.889: J90.30 J90.29 J90.28 J90.27 J90.26 J90.25 J90.24 J90.23 J90.22 J90.21 J90.20 J90.19 J90.18 J90.17 J90.16 J90.15 J90.14 J90.13 J90.12 J90.11 J90.10 J90.9 J90.8 J90.7 J90.6 J90.5 J90.4 J90.3 J90.2 J90.1
N$2
  Bottom 0.889: J89.1 J89.2 J89.3 J89.4 J89.5 J89.6 J89.7 J89.8 J89.9 J89.10 J89.11 J89.12 J89.13 J89.14 J89.15 J89.16 J89.17 J89.18 J89.19 J89.20 J89.21 J89.22 J89.23 J89.24 J89.25 J89.26 J89.27 J89.28 J89.29 J89.30
N$3
  Bottom 0.889: J95.30 J95.29 J95.28 J95.27 J95.26 J95.25 J95.24 J95.23 J95.22 J95.21 J95.20 J95.19 J95.18 J95.17 J95.16 J95.15 J95.14 J95.13 J95.12 J95.11 J95.10 J95.9 J95.8 J95.7 J95.6 J95.5 J95.4 J95.3 J95.2 J95.1
N$4
  Bottom 0.889: J94.1 J94.2 J94.3 J94.4 J94.5 J94.6 J94.7 J94.8 J94.9 J94.10 J94.11 J94.12 J94.13 J94.14 J94.15 J94.16 J94.17 J94.18 J94.19 J94.20 J94.21 J94.22 J94.23 J94.24 J94.25 J94.26 J94.27 J94.28 J94.29 J94.30
N$5
  Bottom 0.889: J92.4 J92.3 J92.2 J92.1
N$6
  Bottom 0.889: J96.1 J96.2 J96.3 J96.4
N$7
  Bottom 0.889: J10.4 J10.3 J10.2 J10.1
N$8
  Bottom 0.889: J12.1 J12.2 J12.3 J12.4
N$9
  Bottom 0.889: J22.5 J22.4 J22.3 J22.2 J22.1
N$10
  Bottom 0.889: J24.1 J24.2 J24.3 J24.4 J24.5
N$11
  Bottom 0.889: J26.5 J26.4 J26.3 J26.2 J26.1
N$12
  Bottom 0.889: J28.1 J28.2 J28.3 J28.4 J28.5
N$13
  Bottom 0.889: J30.5 J30.4 J30.3 J30.2 J30.1
N$14
  Bottom 0.889: J32.1 J32.2 J32.3 J32.4 J32.5
N$15
  Bottom 0.889: J34.5 J34.4 J34.3 J34.2 J34.1
N$16
  Bottom 0.889: J36.1 J36.2 J36.3 J36.4 J36.5
N$17
  Bottom 0.889: J38.5 J38.4 J38.3 J38.2 J38.1
N$18
  Bottom 0.889: J40.1 J40.2 J40.3 J40.4 J40.5
N$19
  Bottom 0.889: J42.5 J42.4 J42.3 J42.2 J42.1
N$20
  Bottom 0.889: J44.1 J44.2 J44.3 J44.4 J44.5
N$22
  Bottom 0.889: J14.2 J14.1
N$23
  Bottom 0.889: J16.2 J16.1
N$40
  Bottom 0.889: J91.4 J91.3 J91.2 J91.1
N$41
  Bottom 0.889: J93.1 J93.2 J93.3 J93.4
N$42
  Bottom 0.889: J9.4 J9.3 J9.2 J9.1
N$43
  Bottom 0.889: J11.1 J11.2 J11.3 J11.4
N$44
  Bottom 0.889: J21.5 J21.4 J21.3 J21.2 J21.1
N$45
  Bottom 0.889: J23.1 J23.2 J23.3 J23.4 J23.5
N$46
  Bottom 0.889: J25.5 J25.4 J25.3 J25.2 J25.1
N$47
  Bottom 0.889: J27.1 J27.2 J27.3 J27.4 J27.5
N$48
  Bottom 0.889: J29.5 J29.4 J29.3 J29.2 J29.1
N$49
  Bottom 0.889: J31.1 J31.2 J31.3 J31.4 J31.5
N$50
  Bottom 0.889: J33.5 J33.4 J33.3 J33.2 J33.1
N$51
  Bottom 0.889: J35.1 J35.2 J35.3 J35.4 J35.5
N$52
  Bottom 0.889: J37.5 J37.4 J37.3 J37.2 J37.1
N$53
  Bottom 0.889: J39.1 J39.2 J39.3 J39.4 J39.5
N$54
  Bottom 0.889: J41.5 J41.4 J41.3 J41.2 J41.1
N$55
  Bottom 0.889: J43.1 J43.2 J43.3 J43.4 J43.5
N$58
  Top 0.127: R11.1 47.68,20.32 52.7,20.32 J83.2 55.19,22.8 R12.2
N$59
  Top 0.127: 50.16,22.86 49.53,22.23 47.68,22.23 R13.1 | J84.2 50.16,22.86 | R14.2 50.16,25.98 50.16,22.86
N$60
  Top 0.127: R16.1 LED4.A
N$61
  Top 0.127: R15.1 LED3.A
NRST  (via drill 0.35)
  Top 0.127: v20.32,17.78 S2.3 16.64,17.78 C20.1 16.38,17.78 v8.26,17.78 | U3.7 35.17,24.38 v31.75,20.95 | S2.4 v22.86,17.78
  Bottom 0.127: J86.15 v20.32,17.78 21.59,19.05 22.86,19.05 | J82.10 8.26,23.5 v8.26,17.78 6.99,16.51 | v31.75,20.95 29.84,19.05 22.86,19.05 | v22.86,17.78 22.86,19.05
  Bottom 0.152: 6.99,16.51 6.92,16.45 J98.5
  Bottom 0.889: J52.1 J52.2 J86.15
OSC32_IN
  Top 0.254: Q4.3 36.02,22.36 U3.3
OSC_IN
  Top 0.254: U3.5 37.35,23.38 37.84,23.86 Q3.3
PA0  (via drill 0.35)
  Top 0.127: U3.10 35.41,25.88 v34.92,25.4
  Bottom 0.127: v34.92,25.4 38.73,21.59 42.55,21.59 45.72,18.41 J86.5
  Bottom 0.889: J72.1 J72.2 J86.5
PA1  (via drill 0.35)
  Top 0.127: U3.11 35.27,26.38 34.92,26.04 v34.29,26.04
  Bottom 0.127: J86.4 48.26,16.51 42.55,22.23 38.73,22.23 34.92,26.04 v34.29,26.04
  Bottom 0.889: J74.1 J74.2 J86.4
PA2  (via drill 0.35)
  Top 0.127: U3.12 35.13,26.88 v34.92,26.67
  Bottom 0.127: v34.92,26.67 38.73,22.86 42.55,22.86 50.16,15.24 J86.3
  Bottom 0.889: J76.1 J76.2 J86.3
PA3
  Top 0.127: J86.1 56.52,15.88 56.52,27.3 55.88,27.94 46.35,27.94 J85.1 44.07,30.23 36.35,30.23 U3.13 | J85.2 R16.2
  Bottom 0.127: J85.1 J85.2
  Bottom 0.889: J80.1 J80.2 J86.1
PA4  (via drill 0.35)
  Top 0.127: U3.14 34,29.55 34.29,29.84 v34.92,29.84
  Bottom 0.127: v34.92,29.84 35.56,30.48 53.34,30.48 J87.1
  Bottom 0.889: J79.2 J79.1 J87.1
PA5  (via drill 0.35)
  Top 0.127: U3.15 33.5,29.69 v33.66,29.84
  Bottom 0.127: v33.66,29.84 34.92,31.11 51.44,31.11 J87.2
  Bottom 0.889: J77.2 J77.1 J87.2
PA6
  Top 0.127: U3.16 33,29.82 33.66,30.48 48.26,30.48 J87.3
  Bottom 0.889: J75.2 J75.1 J87.3
PA7
  Top 0.127: U3.17 32.5,29.96 33.27,30.73 45.97,30.73 J87.4
  Bottom 0.889: J73.2 J73.1 J87.4
PA8*
  Top 0.127: U3.29 26.55,24.88 23.88,27.56 23.88,32 J88.3
  Bottom 0.889: J53.2 J53.1 J88.3
PA9*  (via drill 0.35)
  Top 0.127: U3.30 26.42,24.38 v23.5,27.3
  Bottom 0.127: J88.4 20.32,30.48 v23.5,27.3
  Bottom 0.889: J51.2 J51.1 J88.4
PA10*  (via drill 0.35)
  Top 0.127: U3.31 26.29,23.88 v21.59,28.57
  Bottom 0.127: v21.59,28.57 17.78,32.38 J88.5
  Bottom 0.889: J49.2 J49.1 J88.5
PB0
  Top 0.127: U3.18 32,30.09 32.89,30.99 43.69,30.99 J87.5
  Bottom 0.889: J71.2 J71.1 J87.5
PB1
  Top 0.127: U3.19 31.5,30.23 32.51,31.24 41.4,31.24 J87.6
  Bottom 0.889: J69.2 J69.1 J87.6
PB5
  Top 0.127: U3.41 31,18.58 27.94,15.52 J86.12
  Bottom 0.889: J58.1 J58.2 J86.12
PB6*
  Top 0.127: U3.42 31.5,18.72 30.48,17.7 J86.11
  Bottom 0.889: J60.1 J60.2 J86.11
PB7*
  Top 0.127: U3.43 32,18.86 31.34,18.19 31.34,16.29 32.38,15.24 J86.10
  Bottom 0.889: J62.1 J62.2 J86.10
PB8*  (via drill 0.35)
  Top 0.127: U3.45 33,19.03 v32.38,18.41
  Bottom 0.127: v32.38,18.41 J86.9
  Bottom 0.889: J64.1 J64.2 J86.9
PB9*  (via drill 0.35)
  Top 0.127: U3.46 33.5,18.57 v33.66,18.41
  Bottom 0.127: v33.66,18.41 35.56,16.51 36.83,16.51 J86.8
  Bottom 0.889: J66.1 J66.2 J86.8
PB10*
  Top 0.127: U3.21 30.5,29.86 31.24,30.61 31.32,30.61 32.21,31.5 36.58,31.5 J87.8
  Bottom 0.889: J65.2 J65.1 J87.8
PB11*
  Top 0.127: U3.22 30,30 30.86,30.86 31.22,30.86 32.11,31.75 34.29,31.75 J87.9
  Bottom 0.889: J63.2 J63.1 J87.9
PB12*
  Top 0.127: U3.25 27.3,27.07 27.3,30.48 27.94,31.11 31.11,31.11 J87.10
  Bottom 0.889: J61.2 J61.1 J87.10
PB13*
  Top 0.127: U3.26 26.96,26.38 26.67,26.67 26.67,30.48 27.94,31.75 29.21,31.75 J87.11
  Bottom 0.889: J59.2 J59.1 J87.11
PB14*
  Top 0.127: U3.27 26.82,25.88 26.04,26.67 26.04,31.11 J88.1
  Bottom 0.889: J57.2 J57.1 J88.1
PB15*
  Top 0.127: U3.28 26.69,25.38 24.13,27.94 24.13,31.75 J88.2
  Bottom 0.889: J55.2 J55.1 J88.2
PC13  (via drill 0.35)
  Top 0.127: U3.2 37.17,21.88 v37.47,21.59 | v42.55,19.68 43.18,19.05 J86.6
  Bottom 0.127: v37.47,21.59 39.37,19.68 v42.55,19.68
  Bottom 0.889: J70.1 J70.2 J86.6
SWCLK*  (via drill 0.35)
  Top 0.127: U3.37 28.17,19.05 18.41,19.05 17.14,20.32 15.24,20.32 14.61,19.68 v10.16,19.68 8.26,19.68
  Top 0.152: J98.2 5.02,16.45 8.26,19.68
  Bottom 0.127: J86.19 v10.16,19.68 10.16,21.59 J82.4
  Bottom 0.889: J20.1 J20.2 J86.19
SWDIO*  (via drill 0.35)
  Top 0.127: U3.34 26.82,22.38 24.77,20.32 17.78,20.32 17.14,20.95 15.24,20.95 v14.61,20.32 11.43,20.32 | 11.43,20.32 6.99,20.32 5.24,18.57 | J82.2 11.43,20.32
  Top 0.152: 5.24,18.57 J98.1
  Bottom 0.127: J86.17 14.61,15.88 v14.61,20.32
  Bottom 0.889: J48.1 J48.2 J86.17
SWO*  (via drill 0.35)
  Top 0.127: U3.39 30,18.93 27.84,16.76 18.13,16.76 v17.77,17.13 v9.54,17.13 v9.53,17.14 7.62,17.14
  Top 0.152: J98.3 4.99,14.51 7.62,17.14
  Bottom 0.127: J86.16 17.78,17.12 v17.77,17.13 | v9.53,17.14 9.53,22.23 J82.6
  Bottom 0.889: J50.1 J50.2 J86.16
USB_DM*
  Top 0.127: U3.32 26.55,23.38 26.04,22.86 19.68,22.86 18.41,24.14 15.43,24.14 15.43,24.13 15.24,24.13 14.61,24.77 14.61,27.3 12.7,29.21 10.79,29.21 | 10.79,29.21 6.99,29.21 5.91,28.14 J97.2 | J88.8 10.16,29.84 10.79,29.21
  Bottom 0.889: J19.2 J19.1 J88.8
USB_DP*  (via drill 0.35)
  Top 0.127: U3.33 27.48,22.86 26.67,22.86 26.04,22.23 17.2,22.23 R9.1 15.24,23.5 13.97,24.77 13.97,27.3 13.34,27.94 12.67,27.94 arc90 12.45,27.72 12.45,27.67 arc-90 12.22,27.45 11.98,27.45 arc-90 11.76,27.67 11.76,28.21 arc90 11.54,28.43 11.29,28.43 arc90 11.07,28.21 11.07,27.67 arc-90 10.85,27.45 10.6,27.45 arc-90 10.38,27.67 10.38,27.72 arc90 10.16,27.94 9.35,27.94 | 9.35,27.94 8.71,27.94 J97.3 | 9.35,27.94 9.35,28.12 v8.89,28.57
  Bottom 0.127: v8.89,28.57 7.62,29.84 J88.9
  Bottom 0.889: J17.2 J17.1 J88.9
VBAT_1.8-3.6V
  Top 0.254: U3.1 35.56,20.94 R10.1 36.75,19 C19.1 40.51,15.24 J86.7
  Bottom 0.889: J68.1 J68.2 J86.7
VDD  (via drill 0.35)
  Top 0.127: R9.2 v18.41,23.5 | R15.2 48.95,29.84 v48.9,29.84
  Top 0.254: v38.73,20.95 38.47,20.69 Q4.4 38.47,18.82 C22.1 | v34.92,20.95 34.5,20.53 U3.48 34.5,17.99 | v28.57,27.3 29,27.73 U3.24 28.07,29.3 C14.1 | v29.21,21.59 29,21.38 U3.36 27.5,19.75 C15.1 C13.1 | 34.5,17.99 34.73,17.77 35.49,17.77 R10.2 | L2.2 41.02,29.46 v41.27,29.21 | v40.01,24.13 40.27,23.86 Q3.4 42.15,23.86 C21.1 | U4.2 v22.86,28.57 | U4.TER v22.86,26.04 | C16.1 33.66,17.14 34.5,17.99
  pour Bottom: 57.78,40.01 57.78,8.26 0,8.26 0,40.01
VIN2
  Top 0.254: D3.C D4.C | D4.C 19.11,27.36 20.57,28.83 U4.3 | D4.C 17.78,26.02 17.16,25.4 C12.1
VIN_4.8-15V
  Top 0.254: J88.6 15.82,33.02 D4.A
  Bottom 0.889: J47.2 J47.1 J88.6
VUSB
  Top 0.254: J88.7 13.34,33.02 15.29,31.06 D3.A
  Bottom 0.254: J88.7 12.7,31.11 9.53,27.94 J97.1
  Bottom 0.889: J45.2 J45.1 J88.7

### Text on the board
tPlace: USB Breakout | A | B | A | ST-Link | B | C | A | A
bPlace: 25 | 30 | 35
tNames: G / D | G / D | D / + | D / - | V / U | V / N | 1 / 0 | 9 | 8 | 1 / 5 | 1 / 4 | 1 / 3 | 1 / 2 | 1 / 1 | 1 / 0 | 2 | 1 | 0 | 7 | 6 | 5 | 4 | * | * | * | * | * | * | * | * | * | * | * | * | PWR | A3-LED2 | + - | + - | USER | 25 | 30 | 35 | RESET | DIO | CLK | J-Link | SWO | <0> BOOT1 <1> | <0> BOOT0 <1> | * | * | * | * | * | * | * | * | * | V / D | C / K | G / D | I / O | S / W | R / S | D / I | T / R | 5 | 6 | 7 | 8 | 9 | B / T | 1 / 3 | 0 | 1 | 2 | A / V | 3
bNames: Max current through any trace (based on width): 3.5A (temperature rise: 35 deg C) | Max voltage between any two traces (based on clearance): 100V (70 V_AC RMS) | FMI: github.com/nathancharlesjones/STM32F103C8T6-breakout-board | A3-LED2 | TRACES / THIS / SIDE | VDD | -------POWER------- / VDD/AVDD: 2-3.6V. Must be / 3.3V if C39- / 097/C387- / 415 are used / for Q1/Q2. / VUSB: 5V from USB (J5) / VIN: 4.8-15V / BAT: 1.8-3.6V. Short / R2 if unused. / ***WARNING***: Do / NOT power MCU from VDD / if EITHER VIN or USB (J5) / are also being used. / --------GPIO-------- / Max current, ea pin: 25 mA / Max current, total: 150 mA / OUT (minus MCU power, ~7 / -50 mA) and 150 mA IN / (minus MCU power) / *=5V tolerant / USER LED (LED2) on PA3; / Cut trace btwn J8 on BOT- / TOM of PCB to remove / --------BOM-------- / All parts 0402 unless noted. / U1: STM32F103C8T6 / U2: 2-3.6V regulator, >= / 150mA / SOT-223 / J3: Debug Edge connector / J4: J-Link connector / J5: Mini-B; TE 2172034-1 / Q1: 8MHz / 3.2x2.5mm / Q2: 32.768kHz / 3.2x2.5mm / L1: ferrite bead, 0805 (leave / open for AVDD other MCU) / C3, C4, C5, C7-C11: 100nF / R1: 1k5 C6: 1uF / C1, C2: 10uF / R3, R5: 10k | R8, R9: 150R / D1, D2: Shottky / SOD-123 / LED1, LED2: 0603 / R2, R4: 0R (use / R4 in lieu of J6/J7) / S1: SPST- / NO 5.1x / 5.1mm | nRST | GD | For more information: github.com/nathancharlesjones/STM32F103C8T6-breakout-board